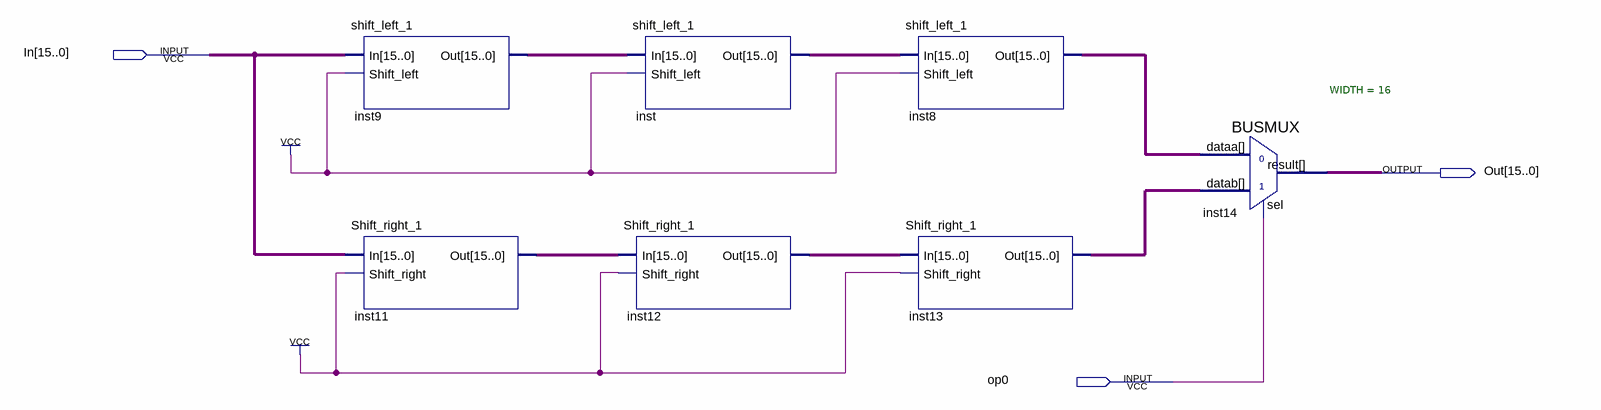
[diagram p0: schematic sheet]
// Quartus schematic Shift3.bdf as structural Verilog: 7 symbols, 3 pins
module Shift3 (
  input  [15:0] In,
  input  op0,
  output [15:0] Out
);

  wire [15:0] inst8_out, inst9_out, inst11_out, inst12_out, inst13_out, inst_out;

  shift_left_1 inst9 (.In(In), .Shift_left(1'b1), .Out(inst9_out));
  Shift_right_1 inst11 (.In(In), .Shift_right(1'b1), .Out(inst11_out));
  shift_left_1 inst (.In(inst9_out), .Shift_left(1'b1), .Out(inst_out));
  Shift_right_1 inst12 (.In(inst11_out), .Shift_right(1'b1), .Out(inst12_out));
  shift_left_1 inst8 (.In(inst_out), .Shift_left(1'b1), .Out(inst8_out));
  Shift_right_1 inst13 (.In(inst12_out), .Shift_right(1'b1), .Out(inst13_out));
  BUSMUX #(.WIDTH(16)) inst14 (.datab(inst13_out), .sel(op0), .dataa(inst8_out), .result(Out));
endmodule
